# EAGLE design LEDboard_v0.4-R001 (EAGLE 9.5.1)
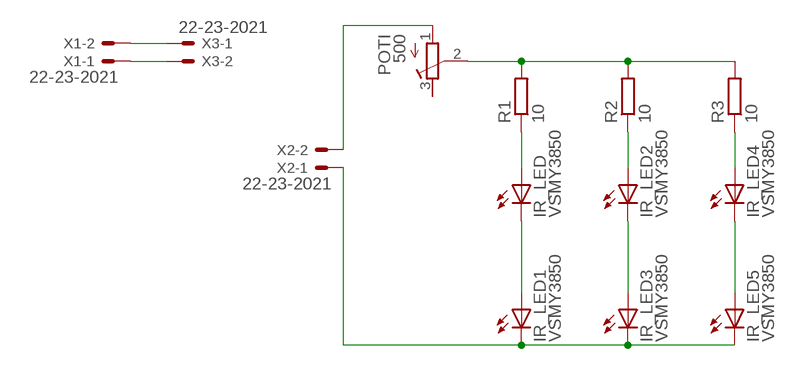
[diagram p0: schematic, sheet 1]

## Parts
IR_LED  VSMY3850  [VSMY3850X]
IR_LED1  VSMY3850  [VSMY3850X]
IR_LED2  VSMY3850  [VSMY3850X]
IR_LED3  VSMY3850  [VSMY3850X]
IR_LED4  VSMY3850  [VSMY3850X]
IR_LED5  VSMY3850  [VSMY3850X]
POTI  500  R-TRIMM64Y  [RTRIM64Y]
R1  10  R-EU_R0805  [R0805]
R2  10  R-EU_R0805  [R0805]
R3  10  R-EU_R0805  [R0805]
X1  22-23-2021  [22-23-2021]
X2  22-23-2021  [22-23-2021]
X3  22-23-2021  [22-23-2021]

## Nets
N$1: IR_LED1.1(A) IR_LED.2(C)
N$2: IR_LED.1(A) R1.1
N$3: IR_LED2.2(C) IR_LED3.1(A)
N$4: IR_LED2.1(A) R2.1
N$5: IR_LED4.2(C) IR_LED5.1(A)
N$6: IR_LED4.1(A) R3.1
N$7: POTI.2(S) R1.2 R2.2 R3.2
N$8: IR_LED1.2(C) IR_LED3.2(C) IR_LED5.2(C) X2.1
N$9: POTI.1(A) X2.2
N$10: X1.2 X3.1
N$11: X1.1 X3.2
Unconnected: POTI.3(E)

## Library data of the parts
IR_LED IR_LED1-IR_LED5 = customizedLibs:VSMY3850: High Speed Infrared Emitting Diode, 850 nm http://www.vishay.com/docs/83399/vsmy3850.pdf DESCRIPTION As part of the SurfLightTM portfolio, the VSMY3850 is an infrared, 850 nm emitting diode based on surface emitter technology with high radiant intensity, high optical power and high speed, molded in a PLCC-2 package for surface mounting (SMD).
POTI = rcl:R-TRIMM: Trimm resistor
R1-R3 = rcl:R-EU_: RESISTOR, European symbol
X1-X3 = con-molex:22-23-2021: .100" (2.54mm) Center Header - 2 Pin; MF: MOLEX; MPN: 22-23-2021; OC_FARNELL: 1462926; OC_NEWARK: 25C3832

## Board
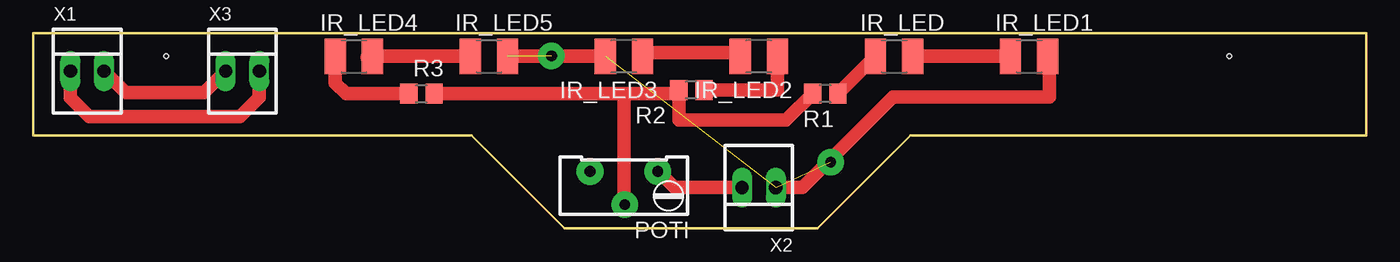
[diagram p1: board, top side]

Size 100.31 x 14.72 mm. Coordinates in mm from the lower left corner, seen from the top.
Outline: 0,7 33,7 40,0 59,0 66,7 100.31,7 100.31,14.72 0,14.72 0,7
Copper layers (1*16): Top 0.035mm / dielectric 1.5mm / Bottom 0.035mm
Design rules "default": minimum track width 6mil, minimum drill 0.35mm, track to track 6mil, track to pad 6mil, pad to pad 6mil, via to via 6mil, smd to smd 6mil, copper to edge 40mil, drill to drill 6mil, minimum pad ring 10mil, minimum via ring 8mil, stop-mask expansion 4mil, vias tented up to drill 0mil, thermal gap 10mil
Holes 0.35 mm at 10,13 90,13

### Footprints (pad centres in the part's own frame; a part is rotated, then mirrored left to right if it is on the bottom)
VSMY3850X = smd 1.6 x 2.7: 1 -1.4,0; 2 1.4,0
RTRIM64Y = drill 0.61: 1 0,-2.54; 2 -2.54,0; 3 0,2.54
R0805 = smd 1.3 x 1.5: 1 -0.95,0; 2 0.95,0
22-23-2021 = drill 1 long: 1 -1.27,0; 2 1.27,0

### Placement (x,y rotation side)
IR_LED  64.77,12.97 0 top
IR_LED1  74.93,12.97 0 top
IR_LED2  54.61,12.97 180 top
IR_LED3  44.45,12.97 180 top
IR_LED4  24.13,12.97 0 top
IR_LED5  34.29,12.97 0 top
POTI  44.45,4.35 90 top
R1  59.61,10.16 180 top
R2  49.53,10.43 180 top
R3  29.21,10.16 0 top
X1  4.06,11.86 0 top
X2  54.61,3.08 180 top
X3  15.75,11.86 0 top

### Tracks (layer width: path | path; a pad name or v marks a point on that pad's centre or on a via)
N$1
  Top 1: IR_LED1.1 IR_LED.2
N$2
  Top 1: IR_LED.1 R1.1
N$3
  Top 1: IR_LED3.1 46.12,13.24 52.94,13.24 IR_LED2.2
N$4
  Top 1: IR_LED2.1 56.01,10.43 R2.1
N$5
  Top 1: IR_LED4.2 25.11,12.93 | 25.11,12.93 | IR_LED5.1 25.3,12.97 25.11,12.93
N$6
  Top 1: R3.1 23.54,10.16 22.73,10.97 IR_LED4.1
N$7
  Top 1: R1.2 56.66,8.16 48.58,8.16 R2.2 48.31,10.16 R3.2 44.45,10.16 POTI.2
N$8  (via drill 0.8 pad 2)  (3 unrouted)
  Top 1: X2.1 57.88,3.08 64.69,9.89 76.47,9.89 76.47,12.83 IR_LED1.2 | IR_LED3.2 43.08,13.04 42.8,12.97 IR_LED5.2
  other vias: 39,13 60,5
N$9
  Top 1: POTI.1 48.26,3.08 X2.2
N$10
  Top 1: X1.2 6.95,10.24 12.86,10.24 X3.1
N$11
  Top 1: X3.2 17.02,9.86 15.59,8.43 4.22,8.43 2.79,9.86 X1.1
N$12  (via drill 0.8 pad 2)
  other vias: 44.5,1.8
N$13  (via drill 0.8 pad 2)
  other vias: 47,4.3
N$14  (via drill 0.8 pad 2)
  other vias: 41.9,4.3